# Altium schematic sheet Power - 5V0.SchDoc
size A4
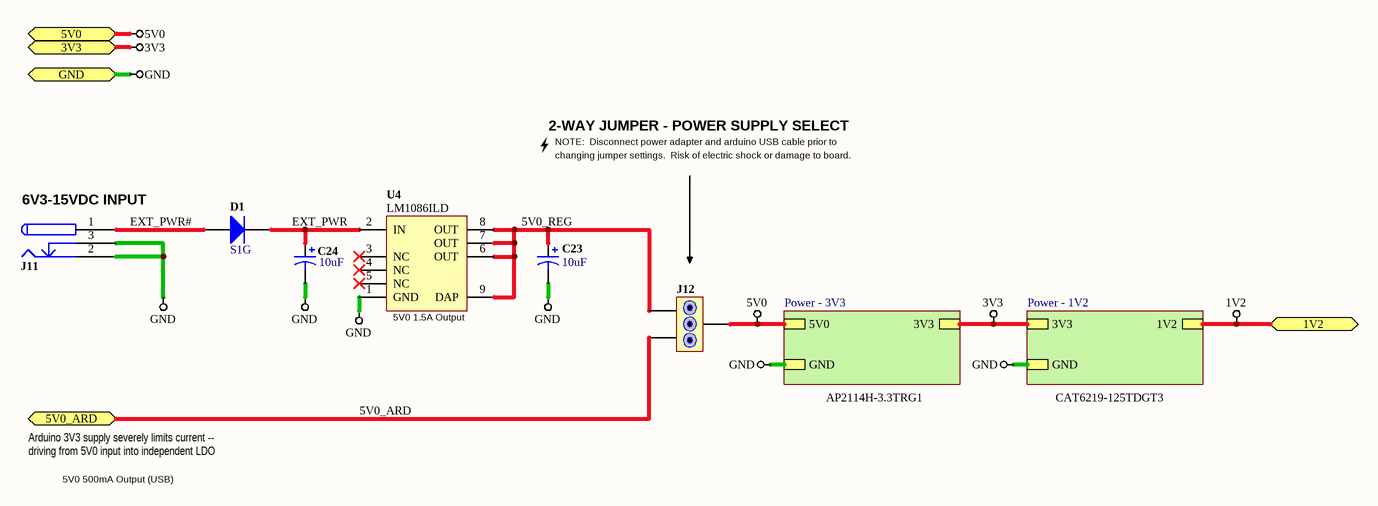
[diagram p0: Power - 5V0.SchDoc]

## Parts
C23  Capacitance: 10uF  [AVX-CAPC3528_V]  (hidden comment: TAJB106K020R)
C24  Capacitance: 10uF  [AVX-CAPC3528_V]  (hidden comment: TAJB106K020R)
D1  S1G  [DO-214AC]
J11  PWR CONNECTOR  [PJ-102AH]  (value not drawn)
J12  3-WAY JUMPER  [HDR1X3]  (value not drawn)
U4  Abbreviated Name: LM1086ILD  [LDC08A]  (hidden comment: LM1086ILD-3.3/NOPB)

## Sub-sheets
Power - 1V2 = Power - 1V2.SchDoc: GND, 3V3, 1V2
Power - 3V3 = Power - 3V3.SchDoc: GND, 5V0, 3V3

## Ports
1V2, 3V3, 5V0, 5V0_ARD, GND

## Nets
1V2: port 1V2, sheet Power - 1V2/1V2
3V3: port 3V3, sheet Power - 3V3/3V3, sheet Power - 1V2/3V3
5V0: J12.2 ; port 5V0, sheet Power - 3V3/5V0
GND: C23.2 C24.2 J11.2 J11.3 U4.1(GND) ; port GND, sheet Power - 3V3/GND, sheet Power - 1V2/GND
5V0_ARD: J12.3 ; port 5V0_ARD
5V0_REG: C23.1 J12.1 U4.6(OUT) U4.7(OUT) U4.8(OUT) U4.9(DAP)
EXT_PWR: C24.1 D1.2 U4.2(IN)
EXT_PWR#: D1.1 J11.1

Not connected (* = marked no-connect by the designer): U4 3(NC)* 4(NC)* 5(NC)*

## Notes on the sheet
- 2-WAY JUMPER - POWER SUPPLY SELECT
- NOTE:  Disconnect power adapter and arduino USB cable prior to
- (near J11) 6V3-15VDC INPUT
- changing jumper settings.  Risk of electric shock or damage to board.
- (near U4) 5V0 1.5A Output
- AP2114H-3.3TRG1
- CAT6219-125TDGT3
- Arduino 3V3 supply severely limits current --
- driving from 5V0 input into independent LDO
- 5V0 500mA Output (USB)

## Library data of the parts
C23 C24 = CMP-0279-00001-1: Capacitor, Tantalum, 10uF 10% 20V MCCT-B (3528); Manufacturer: AVX; Polarity: Polarized; PartNumber: TAJB106K020R; PackageDescription: 2-Pin SMT Capacitor, 3.5 x 2.8 mm Body; ComponentLink1URL: http://www.avx.com/; PackageReference: CAPC3528; ComponentLink2Description: Datasheet; Technology: Tantalum; ComponentLink2URL: http://www.avx.com/docs/Catalogs/taj.pdf; Tolerance: 10%; ComponentLink1Description: Manufacturer URL; Rated Voltage: 20V; DatasheetVersion: Jun-13; Mounting Technology: Surface Mount; Manufacturer_PN: TAJB106K020R; Manufacturer Part Number: TAJB106K020R
D1 = S1G: Fairchild S1G General Purpose Rectifier; Vrrm: 400V; If(AV): 1.0A; Ifsm: 30A; Pd: 1.4W; Trr: 1.8uS; Ct: 6.6pF; Package: DO-214AC; Manufacturer_PN: S1G; Manufacturer Part Number: S1G
J11 = POWER-CONNECTOR-3: Connector, 3 Conductor Power Jack; Manufacturer_PN: CP-102AH-ND; Connector type: POWERJACK 3 HEADER; ClassName: PWR_CONN_5V0; Category: Connector; Mounting Technology: PTH; Pin Count: 3; Manufacturer Part Number: CP-102AH-ND
J12 = 3-WAY JUMPER: 3-Way Jumper - Center Output; Manufacturer_PN: 71417-103HLF; Manufacturer Part Number: 71417-103HLF
U4 = CMP-0062-01489-2: 1.5A Low Dropout Positive Regulators, 8-pin LLP, Pb-Free; Manufacturer: National Semiconductor; PowerWise: N; CompType: LDO IC; PackageTopMarking: NS*UZXYTT*1086I33; ComponentLink1Description: LM1086 Datasheet; RoHS: Y; ComponentLink2URL: http://www.national.com/pf/LM/LM1086.html; PinCount: 8; DatasheetVersion: Jun-2005; ComponentLink2Description: LM1086 Web Page; ComponentLink3URL: http://www.national.com/packaging/folders/ldc08a.html; ComponentLink1URL: http://www.national.com/ds/LM/LM1086.pdf; PackageReference: LDC08A; PackageVersion: revB, Jun-2003; ComponentLink3Description: LDC08A Package Page; PackageDescription: LLP, Plastic, Dual, 4 x 4 x 0.75mm Body, 8 Lead, 0.8mm Pitch; RevisionNote: Component URLs added; Manufacturer_PN: LM1086ILD-3.3/NOPB; Manufacturer Part Number: LM1086ILD-3.3/NOPB